# Altium project RP2040_Evaluation.PrjPcb
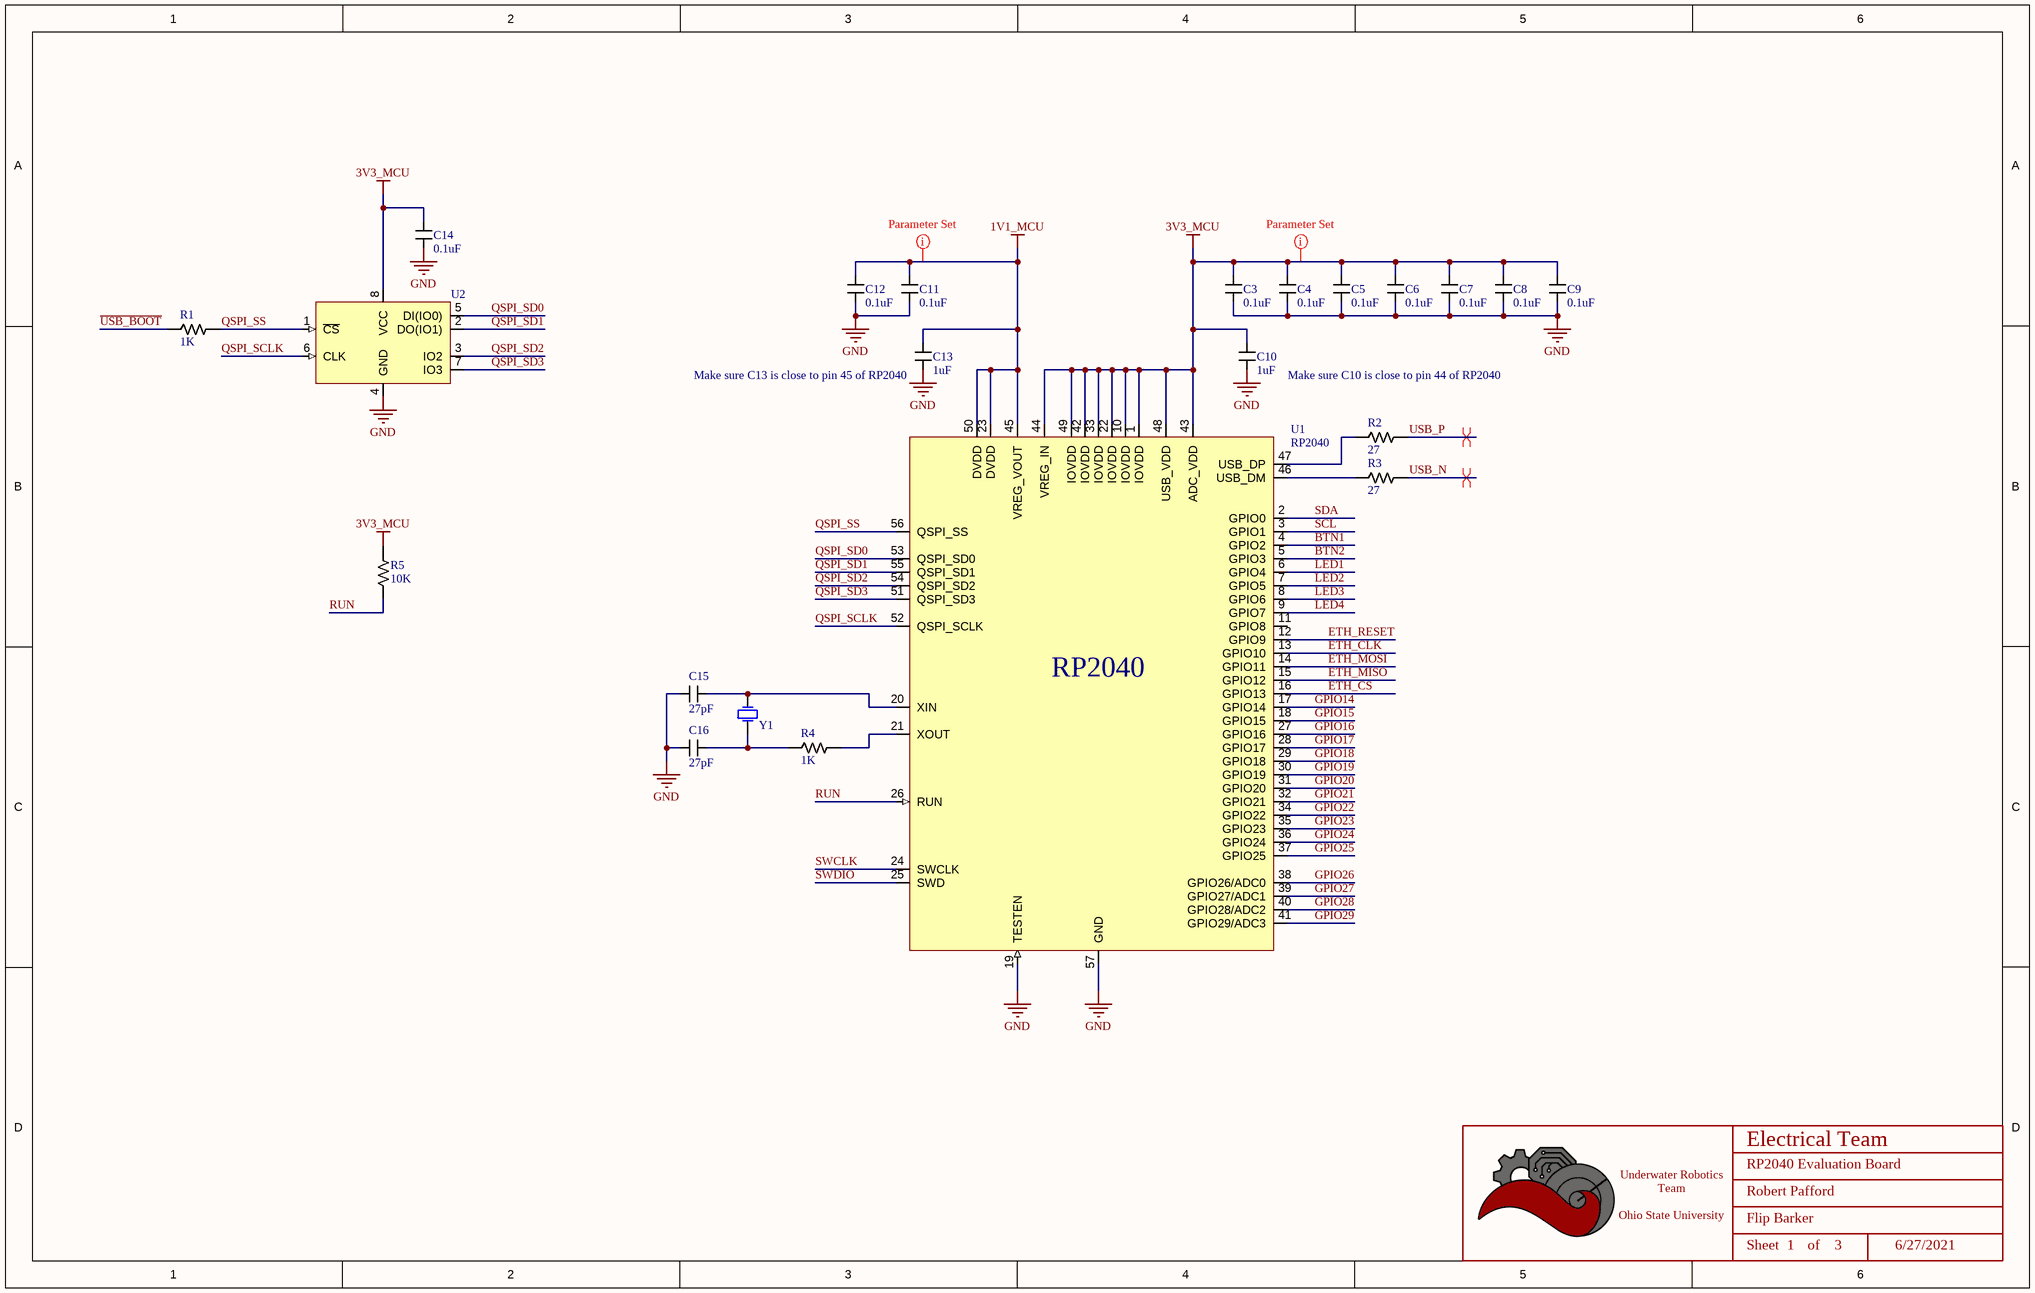
[diagram p0: RP2040_Evaluation_Design.SchDoc]
Project: RP2040 Evaluation; TeamLead: Flip Barker
3 sheets, 69 parts. Net scope: global (net labels, ports and power ports of the same name join across sheets).
Board file: RP2040_Evaluation.PcbDoc
Sheets:
  RP2040_Evaluation_Design.SchDoc
  RP2040_Evaluation_Notes.SchDoc
  RP2040_Evaluation_Connectors.SchDoc

## Sheet RP2040_Evaluation_Design.SchDoc: RP2040 Evaluation Board
size B; Date: 6/27/2021; Author: Robert Pafford; Organization: ORGANIZATION; Address1: ADDRESS 1; Address2: ADDRESS 2; Address3: ADDRESS 3; Address4: ADDRESS 4; Revision: -; SheetNumber: 1; SheetTotal: 3; ENG_APP_DATE: --/--/--; DSN_APP_DATE: --/--/--; CHK_APP_DATE: --/--/--

### Parts
(Parts that share a designator on the sheet are numbered #1, #2 ... from top to bottom, then left to right.)
*#1  Title_Block  (value not drawn)  (graphical)
C3  value 0.1uF  [CAPACITOR_0603]  (hidden comment: 100nF Ceramic 6.3V)
C4  value 0.1uF  [CAPACITOR_0603]  (hidden comment: 100nF Ceramic 6.3V)
C5  value 0.1uF  [CAPACITOR_0603]  (hidden comment: 100nF Ceramic 6.3V)
C6  value 0.1uF  [CAPACITOR_0603]  (hidden comment: 100nF Ceramic 6.3V)
C7  value 0.1uF  [CAPACITOR_0603]  (hidden comment: 100nF Ceramic 6.3V)
C8  value 0.1uF  [CAPACITOR_0603]  (hidden comment: 100nF Ceramic 6.3V)
C9  value 0.1uF  [CAPACITOR_0603]  (hidden comment: 100nF Ceramic 6.3V)
C10  value 1uF  [CAPACITOR_0603]  (hidden comment: 1uF Ceramic 16V)
C11  value 0.1uF  [CAPACITOR_0603]  (hidden comment: 100nF Ceramic 6.3V)
C12  value 0.1uF  [CAPACITOR_0603]  (hidden comment: 100nF Ceramic 6.3V)
C13  value 1uF  [CAPACITOR_0603]  (hidden comment: 1uF Ceramic 16V)
C14  value 0.1uF  [CAPACITOR_0603]  (hidden comment: 100nF Ceramic 6.3V)
C15  value 27pF  [CAPACITOR_0603]  (hidden comment: 27pF Ceramic 50V)
C16  value 27pF  [CAPACITOR_0603]  (hidden comment: 27pF Ceramic 50V)
R1  Value  (Ohms): 1K  [RESISTOR_0603]  (hidden comment: 1k Ohm 5% 1/8W)
R2  Value  (Ohms): 27  [RESISTOR_0603]  (hidden comment: 27 Ohm 5% 1/8W)
R3  Value  (Ohms): 27  [RESISTOR_0603]  (hidden comment: 27 Ohm 5% 1/8W)
R4  Value  (Ohms): 1K  [RESISTOR_0603]  (hidden comment: 1k Ohm 5% 1/8W)
R5  Value  (Ohms): 10K  [RESISTOR_0603]  (hidden comment: 10k Ohm 5% 1/10W)
U1  RP2040  [QFN-56 RP2040]
U2  W25Q128JVSIQ  [SOIC-8 W25QxJV]  (value not drawn)
Y1  CRYSTAL_12MHZ  [CRYSTAL_THROUGH_HOLE]  (value not drawn)

### Nets
1V1_MCU: C11.1 C12.1 C13.1 U1.23(DVDD) U1.45(VREG_VOUT) U1.50(DVDD)
3V3_MCU: C3.1 C4.1 C5.1 C6.1 C7.1 C8.1 C9.1 C10.1 C14.1 R5.1 U1.1(IOVDD) U1.10(IOVDD) U1.22(IOVDD) U1.33(IOVDD) U1.42(IOVDD) U1.43(ADC_VDD) U1.44(VREG_IN) U1.48(USB_VDD) U1.49(IOVDD) U2.8(VCC)
GND: C3.2 C4.2 C5.2 C6.2 C7.2 C8.2 C9.2 C10.2 C11.2 C12.2 C13.2 C14.2 C15.2 C16.2 U1.19(TESTEN) U1.57(GND) U2.4(GND)
BTN1: U1.4(GPIO2)
BTN2: U1.5(GPIO3)
ETH_CLK: U1.13(GPIO10)
ETH_CS: U1.16(GPIO13)
ETH_MISO: U1.15(GPIO12)
ETH_MOSI: U1.14(GPIO11)
ETH_RESET: U1.12(GPIO9)
GPIO14: U1.17(GPIO14)
GPIO15: U1.18(GPIO15)
GPIO16: U1.27(GPIO16)
GPIO17: U1.28(GPIO17)
GPIO18: U1.29(GPIO18)
GPIO19: U1.30(GPIO19)
GPIO20: U1.31(GPIO20)
GPIO21: U1.32(GPIO21)
GPIO22: U1.34(GPIO22)
GPIO23: U1.35(GPIO23)
GPIO24: U1.36(GPIO24)
GPIO25: U1.37(GPIO25)
GPIO26: U1.38(GPIO26/ADC0)
GPIO27: U1.39(GPIO27/ADC1)
GPIO28: U1.40(GPIO28/ADC2)
GPIO29: U1.41(GPIO29/ADC3)
LED1: U1.6(GPIO4)
LED2: U1.7(GPIO5)
LED3: U1.8(GPIO6)
LED4: U1.9(GPIO7)
QSPI_SCLK: U1.52(QSPI_SCLK) U2.6(CLK)
QSPI_SD0: U1.53(QSPI_SD0) U2.5(DI(IO0))
QSPI_SD1: U1.55(QSPI_SD1) U2.2(DO(IO1))
QSPI_SD2: U1.54(QSPI_SD2) U2.3(IO2)
QSPI_SD3: U1.51(QSPI_SD3) U2.7(IO3)
QSPI_SS: R1.1 U1.56(QSPI_SS) U2.1(~{CS})
RUN: R5.2 U1.26(RUN)
SCL: U1.3(GPIO1)
SDA: U1.2(GPIO0)
SWCLK: U1.24(SWCLK)
SWDIO: U1.25(SWD)
~{USB_BOOT}: R1.2
USB_N: R3.1
USB_P: R2.1
NetC15_1: C15.1 U1.20(XIN) Y1.2
NetC16_1: C16.1 R4.2 Y1.1
NetR2_2: R2.2 U1.47(USB_DP)
NetR3_2: R3.2 U1.46(USB_DM)
NetR4_1: R4.1 U1.21(XOUT)

Not connected (* = marked no-connect by the designer): U1 11(GPIO8)

### Layout directives
differential pair; differential pair class USB 2.0: USB_N, USB_P
rule Supply Nets [Voltage = 1.100]: 1V1_MCU
rule Supply Nets [Voltage = 3.300]: 3V3_MCU

### Notes on the sheet
- (near C13) Make sure C13 is close to pin 45 of RP2040
- Make sure C10 is close to pin 44 of RP2040
- DWG. NO.
- REV.
- SHT.
- THIS DOCUMENT AND THE DATA DISCLOSED HEREIN OR HEREWITH IS THE PROPERTY OF ALTIUM LIMITED AND MAY BE FREELY DISTRIBUTED IN WHOLE. NO RIGHTS ARE RESERVED OR EXPRESS OR IMPLIED WARANTEE GIVEN.
- REVISION
- DESCRIPTION
- DATE
- APPROVED
- ENG:
- APPROVALS
- PROJECT
- DSN:
- CHK:
- REFERENCE DOCUMENTS
- PROJECT REVISION:
- TITLE
- DOCUMENT REVISION:
- DESIGN ITEM:
- BOM:
- FAB DWG:
- PCB DWG:
- ASSY DWG:
- SCALE:
- SIZE
- B
- CAGE CODE
- FILE NAME
- DWG NO.
- SHEET
- OF
- REV
- (in symbol Title_Block) Electrical Team; Underwater Robotics Team / Ohio State University; Sheet; of

### Library data of the parts
*#1 = Title_Block: UWRT Schematic Title Block Template / Created June 2021, Dylan Trainor
C3-C9 C11 C12 C14 = CAPACITOR_0.1uF_0603: Cap 100nF 6.3V +/-10% / Ceramic 0603; Made By: Flip B; ComponentLink1Description: Datsheet; ComponentLink1URL: https://www.mouser.com/datasheet/2/212/KEM_C1002_X7R_SMD-1102033.pdf; Tolerance: +/- 10%; Voltage: 6.3V; Supplier 1: Digi-Key; Supplier Part Number 1: 399-15351-1-ND
C10 C13 = CAPACITOR_1uF_0603: Cap 1uF 16V +/-10% / Ceramic 0603; Made By: Flip B; Tolerance: +/- 10%; Voltage: 16V; Supplier 1: Digi-Key; Supplier Part Number 1: 399-7847-1-ND
C15 C16 = CAPACITOR_0.000027uF_0603: Cap 27pF 50V +/-5% / Ceramic 0603; Made By: Flip B; ComponentLink1Description: Datsheet; ComponentLink1URL: https://www.mouser.com/datasheet/2/212/KEM_C1002_X7R_SMD-1102033.pdf; Tolerance: +/- 5%; Voltage: 50V; Supplier 1: Digi-Key; Supplier Part Number 1: 311-1063-1-ND
R1 R4 = RESISTOR_1K_0603: RES 1k OHM 5% 1/10W 0603; Tolerance: +/- 5%; Made By: Flip B; ComponentLink1Description: Datasheet; ComponentLink1URL: https://www.bourns.com/docs/product-datasheets/CRxxxxx.pdf; Wattage: 1/10W; Supplier: Digikey; Digikey Part Numer: CR0603-JW-104ELFTR-ND; Supplier 1: Digi-Key; Supplier Part Number 1: 2019-RK73B1JTTD102JCT-ND
R2 R3 = RESISTOR_27_0603: RES 27 OHM 5% 1/8W 0603; Tolerance: +/- 5%; Wattage: 1/10W; Made By: Flip B; ComponentLink1Description: Datasheet; ComponentLink1URL: https://www.bourns.com/docs/product-datasheets/CRxxxxx.pdf; Supplier: Digikey; Digikey Part Numer: CR0603-JW-104ELFTR-ND; Supplier 1: Digi-Key; Supplier Part Number 1: 2019-RK73B1JTTD270JCT-ND
R5 = RESISTOR_10K_0603: RES 10k OHM 5% 1/10W 0603; Tolerance: +/- 5%; Wattage: 1/8W; Made By: Robert Pafford; ComponentLink1Description: Datasheet; ComponentLink1URL: https://www.bourns.com/docs/product-datasheets/CRxxxxx.pdf; Supplier: Digikey; Digikey Part Numer: CR0603-JW-104ELFTR-ND; Supplier 1: Digi-Key; Supplier Part Number 1: 2019-RK73B1JTTD103JCT-ND
U1 = RP2040: Raspberry Pi RP2040; ComponentLink1Description: DigiKey; ComponentLink1URL: *
U2 = W25Q128JVSIQ: IC FLASH 128MBIT SPI/QUAD 8SOIC; Supplier 1: Digi-Key; Supplier Part Number 1: W25Q128JVSIQ-ND
Y1 = CRYSTAL_12MHZ: CRYSTAL 12.0000MHZ 18PF TH; Supplier 1: Digi-Key; Supplier Part Number 1: 50-ECS-120-18-4X-CKM-ND

## Sheet RP2040_Evaluation_Notes.SchDoc: RP2040 Evaluation Notes
size B; Date: 6/27/21; Author: Robert Pafford; Organization: ORGANIZATION; Address1: ADDRESS 1; Address2: ADDRESS 2; Address3: ADDRESS 3; Address4: ADDRESS 4; Revision: -; SheetNumber: 3; SheetTotal: 3; ENG_APP_DATE: --/--/--; DSN_APP_DATE: --/--/--; CHK_APP_DATE: --/--/--
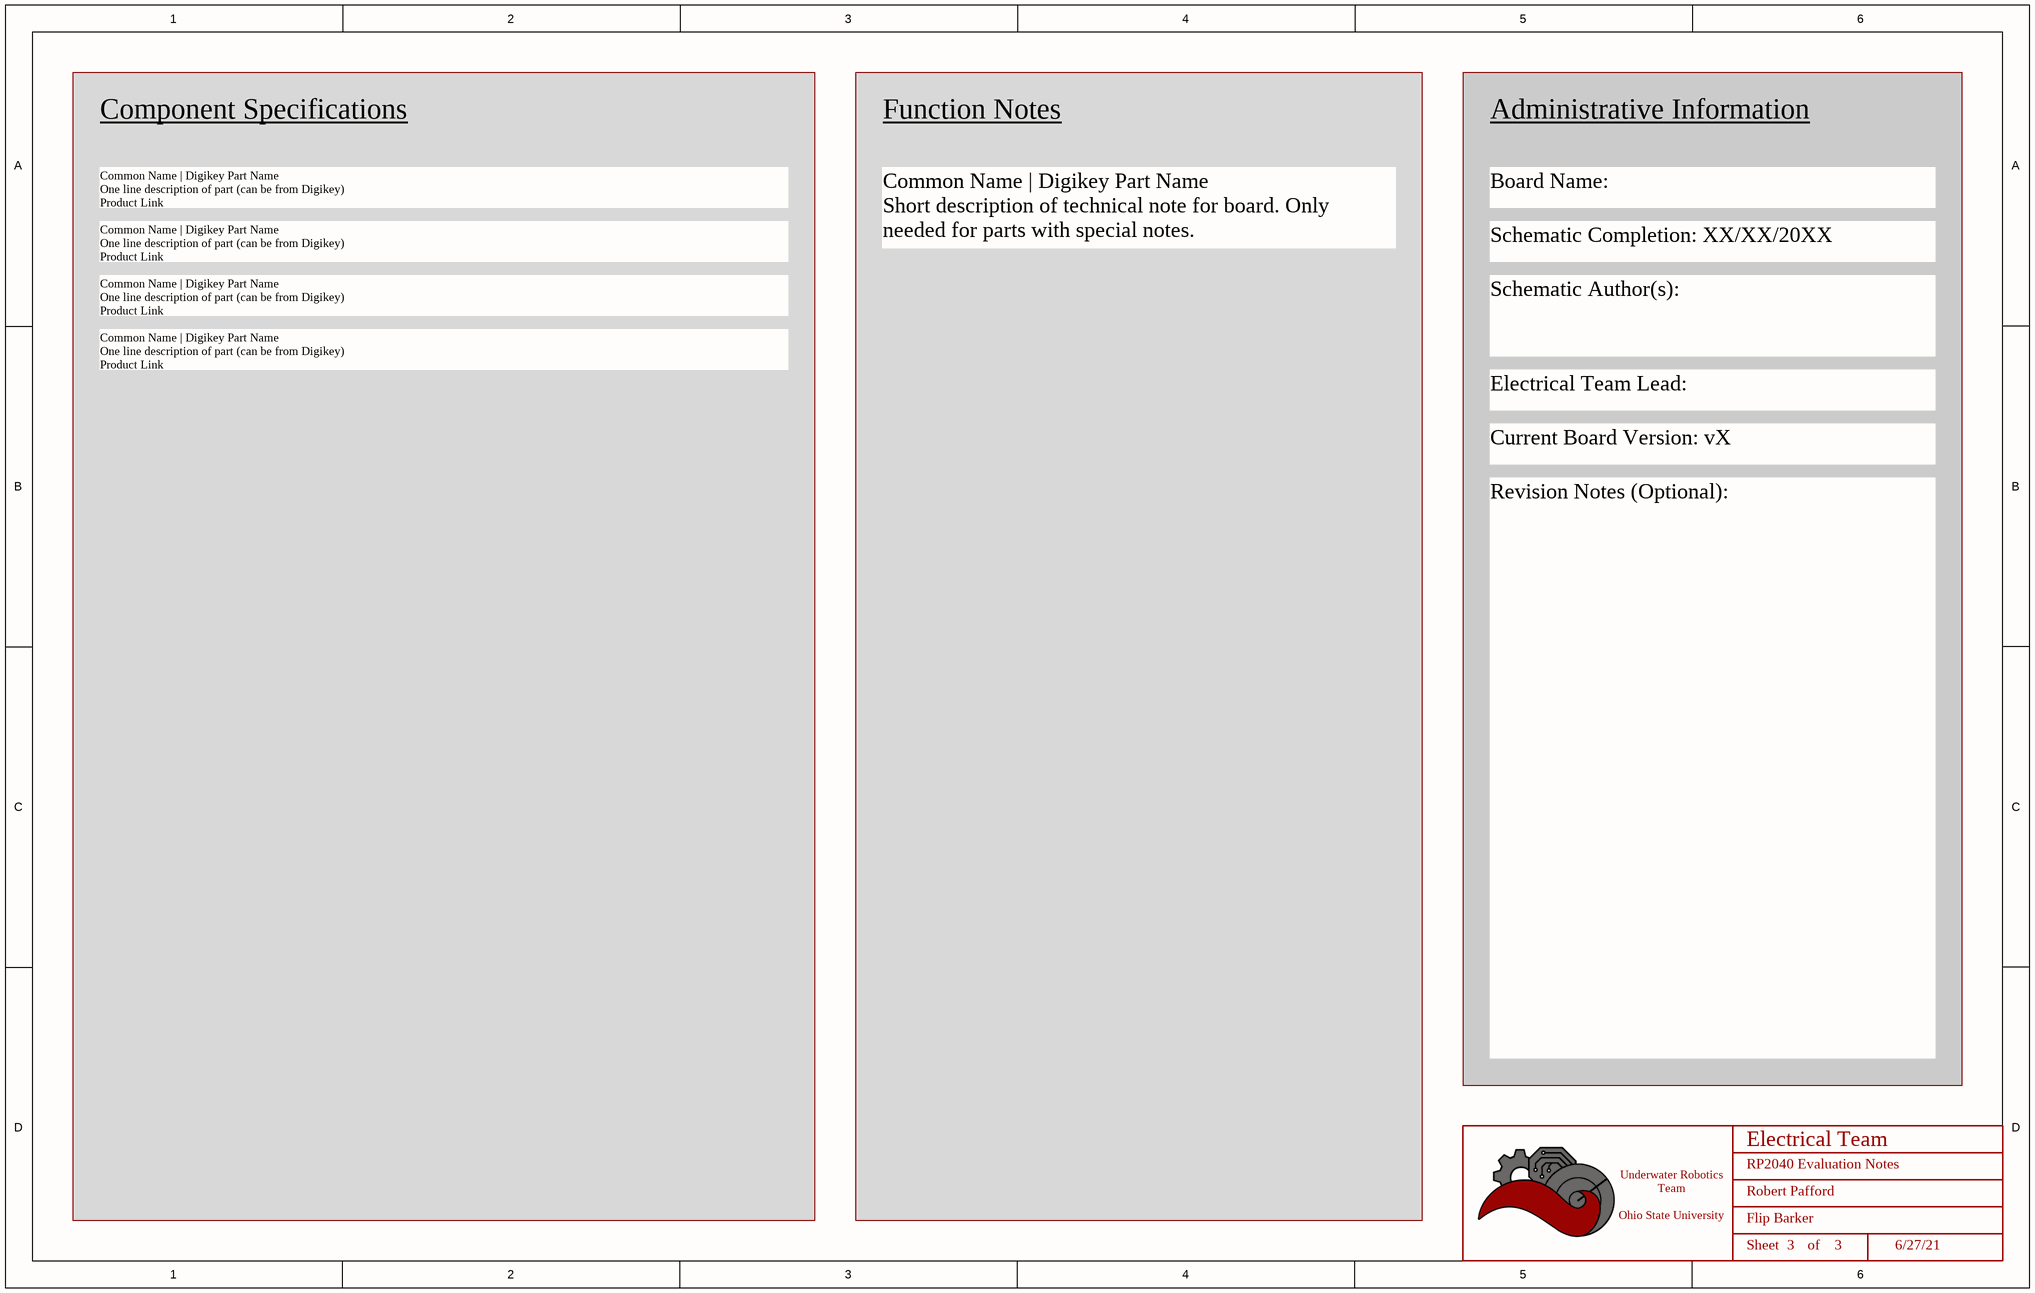
[diagram p1: RP2040_Evaluation_Notes.SchDoc]

### Parts
(Parts that share a designator on the sheet are numbered #1, #2 ... from top to bottom, then left to right.)
*#2  Title_Block  (value not drawn)  (graphical)

### Notes on the sheet
- Component Specifications
- Function Notes
- Administrative Information
- Common Name | Digikey Part Name
  One line description of part (can be from Digikey)
  Product Link
- Board Name:
- Common Name | Digikey Part Name
  Short description of technical note for board. Only needed for parts with special notes.
- Schematic Completion: XX/XX/20XX
- Schematic Author(s):
- Electrical Team Lead:
- Current Board Version: vX
- Revision Notes (Optional):
- DWG. NO.
- REV.
- SHT.
- THIS DOCUMENT AND THE DATA DISCLOSED HEREIN OR HEREWITH IS THE PROPERTY OF ALTIUM LIMITED AND MAY BE FREELY DISTRIBUTED IN WHOLE. NO RIGHTS ARE RESERVED OR EXPRESS OR IMPLIED WARANTEE GIVEN.
- REVISION
- DESCRIPTION
- DATE
- APPROVED
- ENG:
- APPROVALS
- PROJECT
- DSN:
- CHK:
- REFERENCE DOCUMENTS
- PROJECT REVISION:
- TITLE
- DOCUMENT REVISION:
- DESIGN ITEM:
- BOM:
- FAB DWG:
- PCB DWG:
- ASSY DWG:
- SCALE:
- SIZE
- B
- CAGE CODE
- FILE NAME
- DWG NO.
- SHEET
- OF
- REV
- (in symbol Title_Block) Electrical Team; Underwater Robotics Team / Ohio State University; Sheet; of

### Library data of the parts
*#2 = Title_Block: as *#1 on sheet RP2040_Evaluation_Design

## Sheet RP2040_Evaluation_Connectors.SchDoc: RP2040 Evaluation Board
size B; Date: 6/27/21; Author: Robert Pafford; Organization: ORGANIZATION; Address1: ADDRESS 1; Address2: ADDRESS 2; Address3: ADDRESS 3; Address4: ADDRESS 4; Revision: -; SheetNumber: 2; SheetTotal: 3; ENG_APP_DATE: --/--/--; DSN_APP_DATE: --/--/--; CHK_APP_DATE: --/--/--
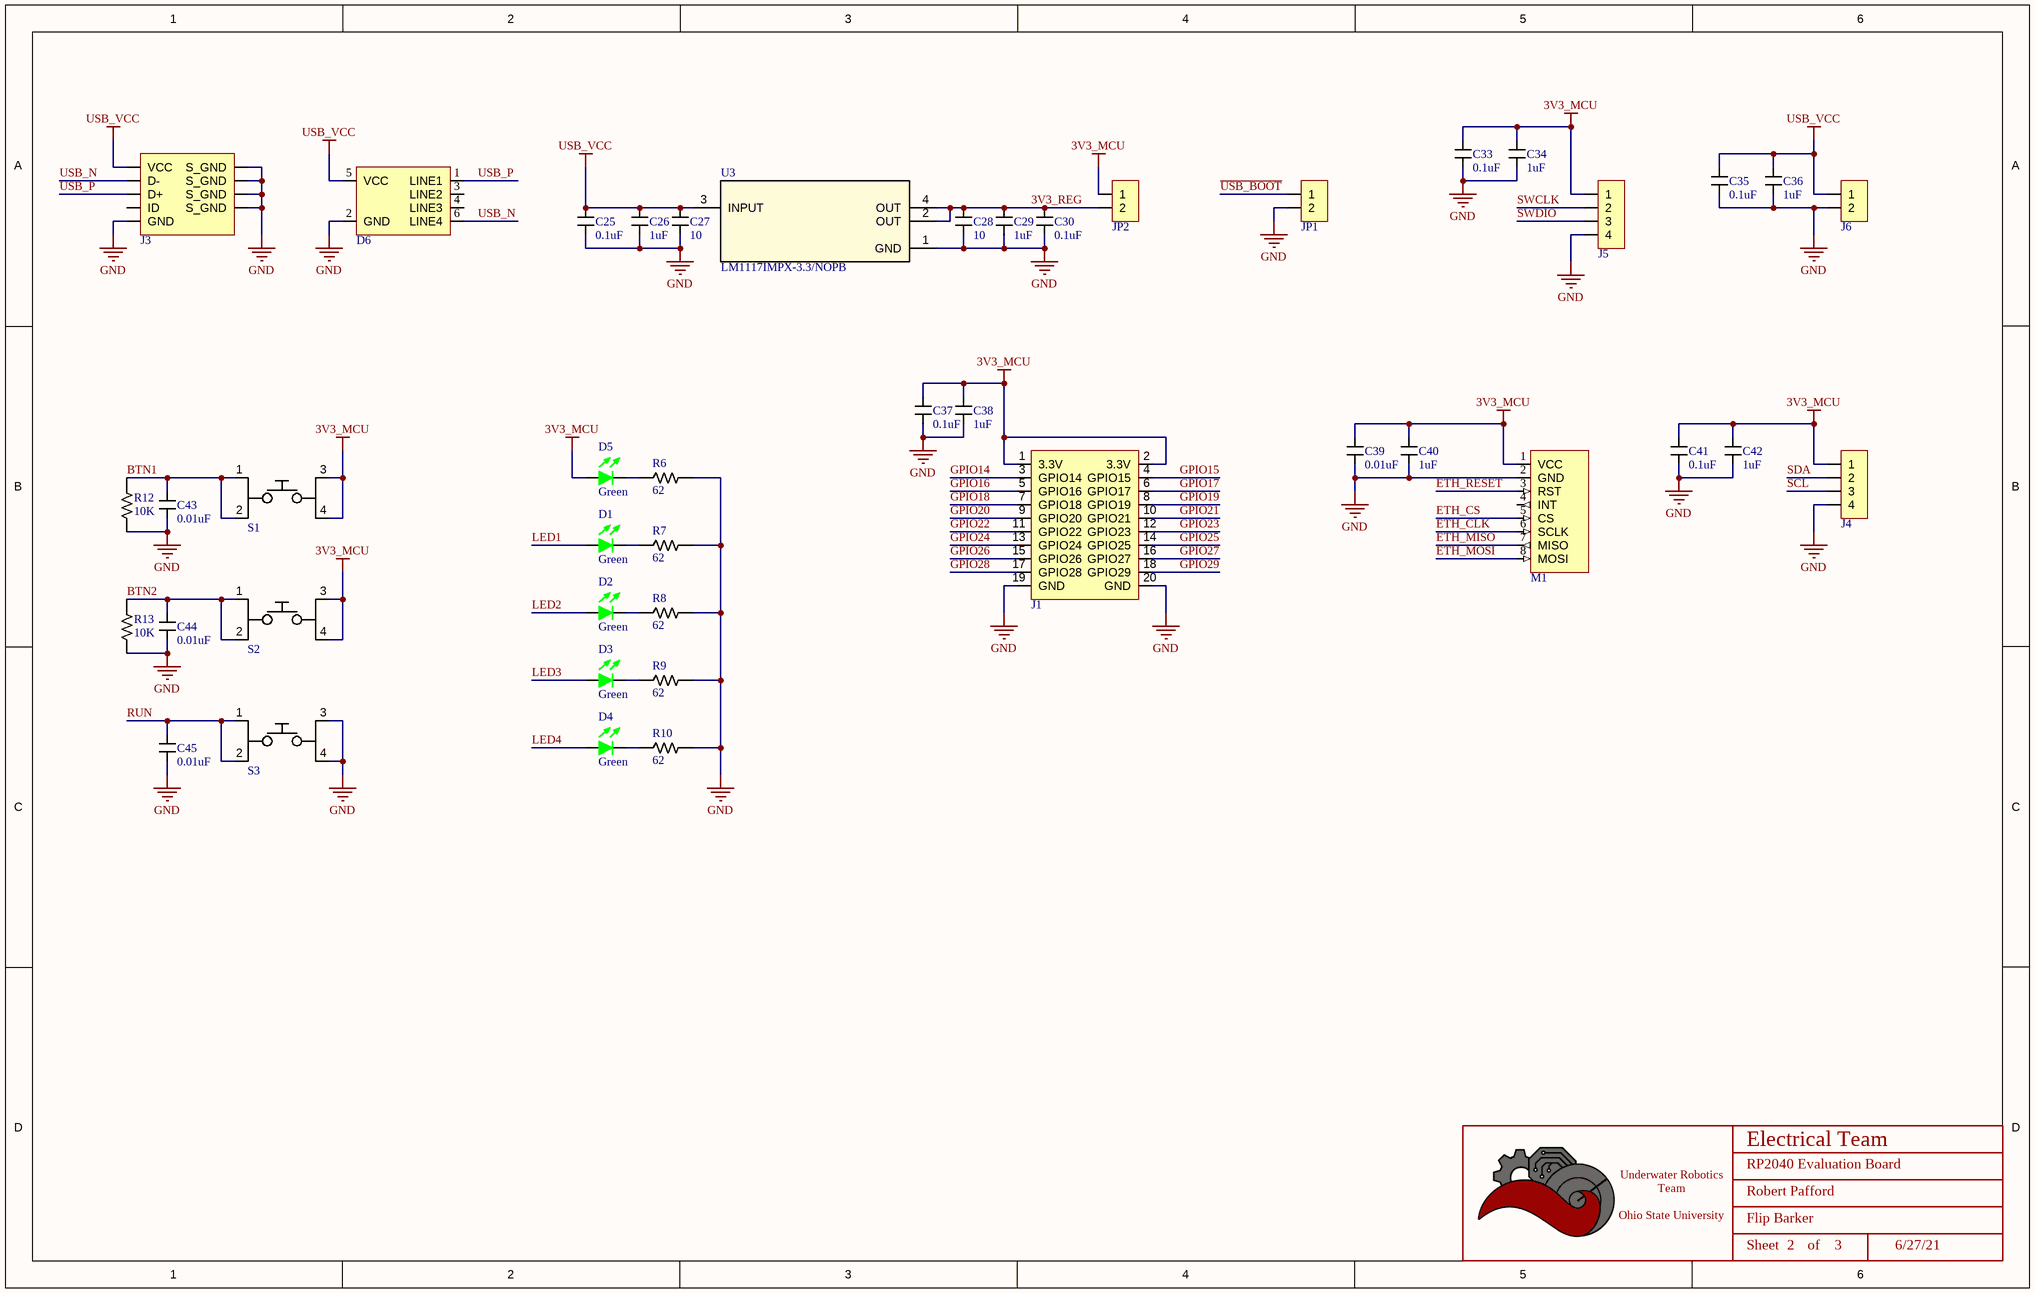
[diagram p2: RP2040_Evaluation_Connectors.SchDoc]

### Parts
(Parts that share a designator on the sheet are numbered #1, #2 ... from top to bottom, then left to right.)
*#3  Title_Block  (value not drawn)  (graphical)
C25  value 0.1uF  [CAPACITOR_0603]  (hidden comment: 100nF Ceramic 6.3V)
C26  value 1uF  [CAPACITOR_0603]  (hidden comment: 1uF Ceramic 16V)
C27  Value (uF): 10  [CAPACITOR_0603]  (hidden comment: 10uF Ceramic 6.3V)
C28  Value (uF): 10  [CAPACITOR_0603]  (hidden comment: 10uF Ceramic 6.3V)
C29  value 1uF  [CAPACITOR_0603]  (hidden comment: 1uF Ceramic 16V)
C30  value 0.1uF  [CAPACITOR_0603]  (hidden comment: 100nF Ceramic 6.3V)
C33  value 0.1uF  [CAPACITOR_0603]  (hidden comment: 100nF Ceramic 6.3V)
C34  value 1uF  [CAPACITOR_0603]  (hidden comment: 1uF Ceramic 16V)
C35  value 0.1uF  [CAPACITOR_0603]  (hidden comment: 100nF Ceramic 6.3V)
C36  value 1uF  [CAPACITOR_0603]  (hidden comment: 1uF Ceramic 16V)
C37  value 0.1uF  [CAPACITOR_0603]  (hidden comment: 100nF Ceramic 6.3V)
C38  value 1uF  [CAPACITOR_0603]  (hidden comment: 1uF Ceramic 16V)
C39  value 0.01uF  [CAPACITOR_0603]  (hidden comment: 10nF Ceramic 6.3V)
C40  value 1uF  [CAPACITOR_0603]  (hidden comment: 1uF Ceramic 16V)
C41  value 0.1uF  [CAPACITOR_0603]  (hidden comment: 100nF Ceramic 6.3V)
C42  value 1uF  [CAPACITOR_0603]  (hidden comment: 1uF Ceramic 16V)
C43  value 0.01uF  [CAPACITOR_0603]  (hidden comment: 10nF Ceramic 6.3V)
C44  value 0.01uF  [CAPACITOR_0603]  (hidden comment: 10nF Ceramic 6.3V)
C45  value 0.01uF  [CAPACITOR_0603]  (hidden comment: 10nF Ceramic 6.3V)
D1  Color: Green  [LED_0603]  (hidden comment: IN-S63AT5G)
D2  Color: Green  [LED_0603]  (hidden comment: IN-S63AT5G)
D3  Color: Green  [LED_0603]  (hidden comment: IN-S63AT5G)
D4  Color: Green  [LED_0603]  (hidden comment: IN-S63AT5G)
D5  Color: Green  [LED_0603]  (hidden comment: IN-S63AT5G)
D6  TVS DIODE 5VWM 25VC SOT23-6  [SOT 23-6L]  (value not drawn)
J1  RP2040 GPIO Header  [HEADER_2x10PIN_2.54MM]  (value not drawn)
J3  USB_MICRO R/A  [CONN_MINIUSB]  (value not drawn)
J4  CONN HEADER VERT 4POS 2.54MM  [HEADER_4PIN_2.54MM]  (value not drawn)
J5  CONN HEADER VERT 4POS 2.54MM  [HEADER_4PIN_2.54MM]  (value not drawn)
J6  2 POS  [HEADER_2PIN_2.54MM]  (value not drawn)
JP1  2 POS  [HEADER_2PIN_2.54MM]  (value not drawn)
JP2  2 POS  [HEADER_2PIN_2.54MM]  (value not drawn)
M1  W5x00 Breakout Board  [W5500IO-P]  (value not drawn)
R6  Value  (Ohms): 62  [RESISTOR_0603]  (hidden comment: 62 Ohm 1% 1/4W)
R7  Value  (Ohms): 62  [RESISTOR_0603]  (hidden comment: 62 Ohm 1% 1/4W)
R8  Value  (Ohms): 62  [RESISTOR_0603]  (hidden comment: 62 Ohm 1% 1/4W)
R9  Value  (Ohms): 62  [RESISTOR_0603]  (hidden comment: 62 Ohm 1% 1/4W)
R10  Value  (Ohms): 62  [RESISTOR_0603]  (hidden comment: 62 Ohm 1% 1/4W)
R12  Value  (Ohms): 10K  [RESISTOR_0603]  (hidden comment: 10k Ohm 5% 1/10W)
R13  Value  (Ohms): 10K  [RESISTOR_0603]  (hidden comment: 10k Ohm 5% 1/10W)
S1  SPST Tactile Switch  [TactileSwitch]  (value not drawn)
S2  SPST Tactile Switch  [TactileSwitch]  (value not drawn)
S3  SPST Tactile Switch  [TactileSwitch]  (value not drawn)
U3  LM1117IMPX-3.3/NOPB  [SOT-223-4]

### Nets
3V3_MCU: C33.1 C34.1 C37.1 C38.1 C39.1 C40.1 C41.1 C42.1 D5.1 J1.1(3.3V) J1.2(3.3V) J4.1 J5.1 JP2.1 M1.1(VCC) S1.3 S1.4 S2.3 S2.4
GND: C25.2 C26.2 C27.2 C28.2 C29.2 C30.2 C33.2 C34.2 C35.2 C36.1 C37.2 C38.2 C39.2 C40.2 C41.2 C42.2 C43.2 C44.2 C45.2 D6.2(GND) J1.19(GND) J1.20(GND) J3.5(GND) J3.6(S_GND) J3.7(S_GND) J3.8(S_GND) J3.9(S_GND) J4.4 J5.4 J6.2 JP1.2 M1.2(GND) R6.1 R7.1 R8.1 R9.1 R10.1 R12.2 R13.2 S3.3 S3.4 U3.1(GND)
USB_VCC: C25.1 C26.1 C27.1 C35.1 C36.2 D6.5(VCC) J3.1(VCC) J6.1 U3.3(INPUT)
3V3_REG: C28.1 C29.1 C30.1 JP2.2 U3.2(OUT) U3.4(OUT)
BTN1: C43.1 R12.1 S1.1 S1.2
BTN2: C44.1 R13.1 S2.1 S2.2
ETH_CLK: M1.6(SCLK)
ETH_CS: M1.5(CS)
ETH_MISO: M1.7(MISO)
ETH_MOSI: M1.8(MOSI)
ETH_RESET: M1.3(RST)
GPIO14: J1.3(GPIO14)
GPIO15: J1.4(GPIO15)
GPIO16: J1.5(GPIO16)
GPIO17: J1.6(GPIO17)
GPIO18: J1.7(GPIO18)
GPIO19: J1.8(GPIO19)
GPIO20: J1.9(GPIO20)
GPIO21: J1.10(GPIO21)
GPIO22: J1.11(GPIO22)
GPIO23: J1.12(GPIO23)
GPIO24: J1.13(GPIO24)
GPIO25: J1.14(GPIO25)
GPIO26: J1.15(GPIO26)
GPIO27: J1.16(GPIO27)
GPIO28: J1.17(GPIO28)
GPIO29: J1.18(GPIO29)
LED1: D1.1
LED2: D2.1
LED3: D3.1
LED4: D4.1
RUN: C45.1 S3.1 S3.2
SCL: J4.3
SDA: J4.2
SWCLK: J5.2
SWDIO: J5.3
~{USB_BOOT}: JP1.1
USB_N: D6.6(LINE4) J3.2(D-)
USB_P: D6.1(LINE1) J3.3(D+)
NetD1_2: D1.2 R7.2
NetD2_2: D2.2 R8.2
NetD3_2: D3.2 R9.2
NetD4_2: D4.2 R10.2
NetD5_2: D5.2 R6.2

Not connected (* = marked no-connect by the designer): D6 3(LINE2) 4(LINE3); J3 4(ID); M1 4(INT)

### Notes on the sheet
- DWG. NO.
- REV.
- SHT.
- THIS DOCUMENT AND THE DATA DISCLOSED HEREIN OR HEREWITH IS THE PROPERTY OF ALTIUM LIMITED AND MAY BE FREELY DISTRIBUTED IN WHOLE. NO RIGHTS ARE RESERVED OR EXPRESS OR IMPLIED WARANTEE GIVEN.
- REVISION
- DESCRIPTION
- DATE
- APPROVED
- ENG:
- APPROVALS
- PROJECT
- DSN:
- CHK:
- REFERENCE DOCUMENTS
- PROJECT REVISION:
- TITLE
- DOCUMENT REVISION:
- DESIGN ITEM:
- BOM:
- FAB DWG:
- PCB DWG:
- ASSY DWG:
- SCALE:
- SIZE
- B
- CAGE CODE
- FILE NAME
- DWG NO.
- SHEET
- OF
- REV
- (in symbol Title_Block) Electrical Team; Underwater Robotics Team / Ohio State University; Sheet; of

### Library data of the parts
*#3 = Title_Block: as *#1 on sheet RP2040_Evaluation_Design
C25 C30 C33 C35 C37 C41 = CAPACITOR_0.1uF_0603: as C3 on sheet RP2040_Evaluation_Design; ComponentLink1Description: Datsheet; ComponentLink1URL: https://www.mouser.com/datasheet/2/212/KEM_C1002_X7R_SMD-1102033.pdf; Tolerance: +/- 10%; Voltage: 6.3V; Supplier 1: Digi-Key; Supplier Part Number 1: 399-15351-1-ND
C26 C29 C34 C36 C38 C40 C42 = CAPACITOR_1uF_0603: as C10 on sheet RP2040_Evaluation_Design; Tolerance: +/- 10%; Voltage: 16V; Supplier 1: Digi-Key; Supplier Part Number 1: 399-7847-1-ND
C27 C28 = CAPACITOR_10uF_0603: Cap 10uF 6.3V +/-20% / Ceramic 0603; Made By: Flip B; ComponentLink1Description: Digikey; ComponentLink1URL: https://www.digikey.com/en/products/detail/samsung-electro-mechanics/CL10A106MQ8NNNC/3886777; Supplier 1: Digi-Key; Supplier Part Number 1: 1276-1119-1-ND; Tolerance: +/- 20%; Voltage: 6.3V
C39 C43-C45 = CAPACITOR_0.01uF_0603: Cap 10nF 6.3V +/-20% / Ceramic 0603; Tolerance: +/- 10%; Made By: Flip B; ComponentLink1Description: Datsheet; ComponentLink1URL: https://www.mouser.com/datasheet/2/212/KEM_C1002_X7R_SMD-1102033.pdf; Voltage: 6.3V; Supplier 1: Mouser; Supplier Part Number 1: 80-C0603C103K9R
D1-D5 = LED_Green_0603_3V: LED Green Vf= 3V If = 0.005A / IN-S63AT5G; Made By: Robert Pafford; Forward Current: 5mA; ComponentLink1Description: Datasheet; ComponentLink1URL: https://www.we-online.de/katalog/datasheet/150060GS75000.pdf; Forward Voltage: 3V; Package: 0603; Supplier 1: Digi-Key; Supplier Part Number 1: 1830-1062-1-ND
D6 = RCLAMP0504S.TCT: 25V Clamp 6A (8/20µs) Ipp Tvs Diode Surface Mount SOT-23-6; Made By: Robert Pafford; Reverse Standoff Voltage (Typ): 5V; Breakdown Voltage (Min): 6V; Supplier 1: Digi-Key; Supplier Part Number 1: RCLAMP0504SCT-ND; Clamping Voltage (Max): 25V
J1 = HEADER_2x10PIN_2.54MM_RP2040_GPIO: CONN HEADER VERT 20POS 2.54MM; Made By: Robert Pafford; Supplier 1: Digi-Key; Supplier Part Number 1: Z8747-ND
J3 = CONN_MICROUSB: Amphenol Micro USB-B / USB2.0 5 Pin Right Angle SMD; Pitch: 0.65mm; Current Per Pin: 1.8A; Number of Positions: 5; Manufacturer: Amphenol; Configuration: Right Angle; Color: Silver; Created By: Flip B; ComponentLink1Description: Datasheet; ComponentLink1URL: https://cdn.amphenol-icc.com/media/wysiwyg/files/documentation/datasheet/inputoutput/io_usb_micro.pdf?__cf_chl_jschl_tk__=05693735e19256298f6ef6ca2bb2e65c376a4f56-1625503833-0-Abitsb0-ufjOXJYs_S3J3r2iTn-nObalbmXUksF1VvO_h_WEmRdMlUD1I8-hmWSEVWzY1pirKnrPZWfgY3851qyBZe5ZvnNQePLGIzUgdEIQBVUyW36RsbYpDLEWxJ4horD-5gChFgobLYqwmG5aHl0E8lIn_twwPPrOxilK2gP0q9t_CNOs_u5fMqXvXUrlsOv8tIE2NRlu6NVP8qtkL2GjhlkeTUbDMF8WvvpPDTFOgvZ4Y16Ej8F8AhWos88mo5B1HssXozw0XrkJQIqERITUu6rqloz9kf4ZzhBHtDAt-IkiAFY_Ds9SW8FYKKTtINJVpHZQ6Gyu1FFM4Dc9MO0maE8_mmNcwlxqyRoRk_MPWW8VyByXWM5RSp52jteRKw7FeI9WIYvCbPAOy0Eyib-aseIQsnGbglBcUY6_2xp8GYaJM38H3dNvBPsSOfJBPndKedwKHllxjkucXn6xsN0sDXkpGN-cu8_2bDTJ0g-uUucKSCooYX-ApSDNGpkA_p9zv1SOAD8c0zaZVmtiBsN75QpVz2rzq9_BFxOywPvR; Series: 10118192; Supplier 1: Digi-Key; Supplier Part Number 1: 609-4613-1-ND
J4 J5 = HEADER_4PIN_2.54MM: Made By: Robert Pafford; Supplier 1: Digi-Key; Supplier Part Number 1: S1012E-04-ND
J6 JP1 JP2 = HEADER_2PIN_2.54MM: CONN HEADER VERT 2POS 2.54MM; Configuration: Vertical; Current Per Pin: 1A; Number of Positions: 2; Manufacturer: *; Pitch: 2.54mm; Color: Natural; Created By: Robert P; ComponentLink1Description: Datasheet; ComponentLink1URL: https://www.molex.com/pdm_docs/sd/026013115_sd.pdf; Series: *; Supplier 1: Digi-Key; Supplier Part Number 1: A121480-ND; Supplier 2: Mouser; Supplier Part Number 2: 571-5-146280-2
M1 = W5500IO-P: W5x00 Breakout Board (W5500IO-P Compatible boards); Made By: Robert Pafford; Voltage: 3.3V; ComponentLink1Description: Product Webpage; ComponentLink1URL: https://maker.wiznet.io/2019/04/02/w5500io-p/
R6-R10 = RESISTOR_62_0603: RES SMD 62 OHM 1% 1/4W 0603; Tolerance: +/- 1%; Made By: Robert Pafford; ComponentLink1Description: Datasheet; ComponentLink1URL: https://www.bourns.com/docs/product-datasheets/CRxxxxx.pdf; Wattage: 1/4W; Supplier: Digikey; Digikey Part Numer: CR0603-JW-104ELFTR-ND; Supplier 1: Digi-Key; Supplier Part Number 1: 541-RCS060362R0FKEACT-ND
R12 R13 = RESISTOR_10K_0603: as R5 on sheet RP2040_Evaluation_Design; ComponentLink1Description: Datasheet; ComponentLink1URL: https://www.bourns.com/docs/product-datasheets/CRxxxxx.pdf; Supplier: Digikey; Digikey Part Numer: CR0603-JW-104ELFTR-ND; Supplier 1: Digi-Key; Supplier Part Number 1: 2019-RK73B1JTTD103JCT-ND
S1-S3 = Tactile Switch: SWITCH TACTILE SPST-NO 0.05A 12V; Made By: Robert Pafford; Supplier 1: Digi-Key; Supplier Part Number 1: EG2494-ND
U3 = LM1117IMPX-3.3/NOPB: IC REG LIN 3.3V 800MA SOT223-4; PartNumber: LM1117IMP-3.3/NOPB; Manufacturer: Texas Instruments; Vin (Max): 15V; Supplier 1: Digi-Key; Supplier Part Number 1: LM1117IMPX-3.3/NOPBCT-ND; Vout (Min/Fixed): 3.3V; Amp Out: 800mA; Package: SOT-223-4; Created By: Dylan T

## Nets that join several sheets
3V3_MCU: RP2040_Evaluation_Design (20 pins), RP2040_Evaluation_Connectors (19 pins)
GND: RP2040_Evaluation_Design (17 pins), RP2040_Evaluation_Connectors (42 pins)
BTN1: RP2040_Evaluation_Design (U1.4), RP2040_Evaluation_Connectors (C43.1 R12.1 S1.1 S1.2)
BTN2: RP2040_Evaluation_Design (U1.5), RP2040_Evaluation_Connectors (C44.1 R13.1 S2.1 S2.2)
ETH_CLK: RP2040_Evaluation_Design (U1.13), RP2040_Evaluation_Connectors (M1.6)
ETH_CS: RP2040_Evaluation_Design (U1.16), RP2040_Evaluation_Connectors (M1.5)
ETH_MISO: RP2040_Evaluation_Design (U1.15), RP2040_Evaluation_Connectors (M1.7)
ETH_MOSI: RP2040_Evaluation_Design (U1.14), RP2040_Evaluation_Connectors (M1.8)
ETH_RESET: RP2040_Evaluation_Design (U1.12), RP2040_Evaluation_Connectors (M1.3)
GPIO14: RP2040_Evaluation_Design (U1.17), RP2040_Evaluation_Connectors (J1.3)
GPIO15: RP2040_Evaluation_Design (U1.18), RP2040_Evaluation_Connectors (J1.4)
GPIO16: RP2040_Evaluation_Design (U1.27), RP2040_Evaluation_Connectors (J1.5)
GPIO17: RP2040_Evaluation_Design (U1.28), RP2040_Evaluation_Connectors (J1.6)
GPIO18: RP2040_Evaluation_Design (U1.29), RP2040_Evaluation_Connectors (J1.7)
GPIO19: RP2040_Evaluation_Design (U1.30), RP2040_Evaluation_Connectors (J1.8)
GPIO20: RP2040_Evaluation_Design (U1.31), RP2040_Evaluation_Connectors (J1.9)
GPIO21: RP2040_Evaluation_Design (U1.32), RP2040_Evaluation_Connectors (J1.10)
GPIO22: RP2040_Evaluation_Design (U1.34), RP2040_Evaluation_Connectors (J1.11)
GPIO23: RP2040_Evaluation_Design (U1.35), RP2040_Evaluation_Connectors (J1.12)
GPIO24: RP2040_Evaluation_Design (U1.36), RP2040_Evaluation_Connectors (J1.13)
GPIO25: RP2040_Evaluation_Design (U1.37), RP2040_Evaluation_Connectors (J1.14)
GPIO26: RP2040_Evaluation_Design (U1.38), RP2040_Evaluation_Connectors (J1.15)
GPIO27: RP2040_Evaluation_Design (U1.39), RP2040_Evaluation_Connectors (J1.16)
GPIO28: RP2040_Evaluation_Design (U1.40), RP2040_Evaluation_Connectors (J1.17)
GPIO29: RP2040_Evaluation_Design (U1.41), RP2040_Evaluation_Connectors (J1.18)
LED1: RP2040_Evaluation_Design (U1.6), RP2040_Evaluation_Connectors (D1.1)
LED2: RP2040_Evaluation_Design (U1.7), RP2040_Evaluation_Connectors (D2.1)
LED3: RP2040_Evaluation_Design (U1.8), RP2040_Evaluation_Connectors (D3.1)
LED4: RP2040_Evaluation_Design (U1.9), RP2040_Evaluation_Connectors (D4.1)
RUN: RP2040_Evaluation_Design (R5.2 U1.26), RP2040_Evaluation_Connectors (C45.1 S3.1 S3.2)
SCL: RP2040_Evaluation_Design (U1.3), RP2040_Evaluation_Connectors (J4.3)
SDA: RP2040_Evaluation_Design (U1.2), RP2040_Evaluation_Connectors (J4.2)
SWCLK: RP2040_Evaluation_Design (U1.24), RP2040_Evaluation_Connectors (J5.2)
SWDIO: RP2040_Evaluation_Design (U1.25), RP2040_Evaluation_Connectors (J5.3)
~{USB_BOOT}: RP2040_Evaluation_Design (R1.2), RP2040_Evaluation_Connectors (JP1.1)
USB_N: RP2040_Evaluation_Design (R3.1), RP2040_Evaluation_Connectors (D6.6 J3.2)
USB_P: RP2040_Evaluation_Design (R2.1), RP2040_Evaluation_Connectors (D6.1 J3.3)